# EasyEDA schematic schematic.json
TITLE: Sheet_1; REV: 1.0; Date: 2024-08-12; Sheet: 1/1; Drawn By: catechisspyros; Company: Your Company
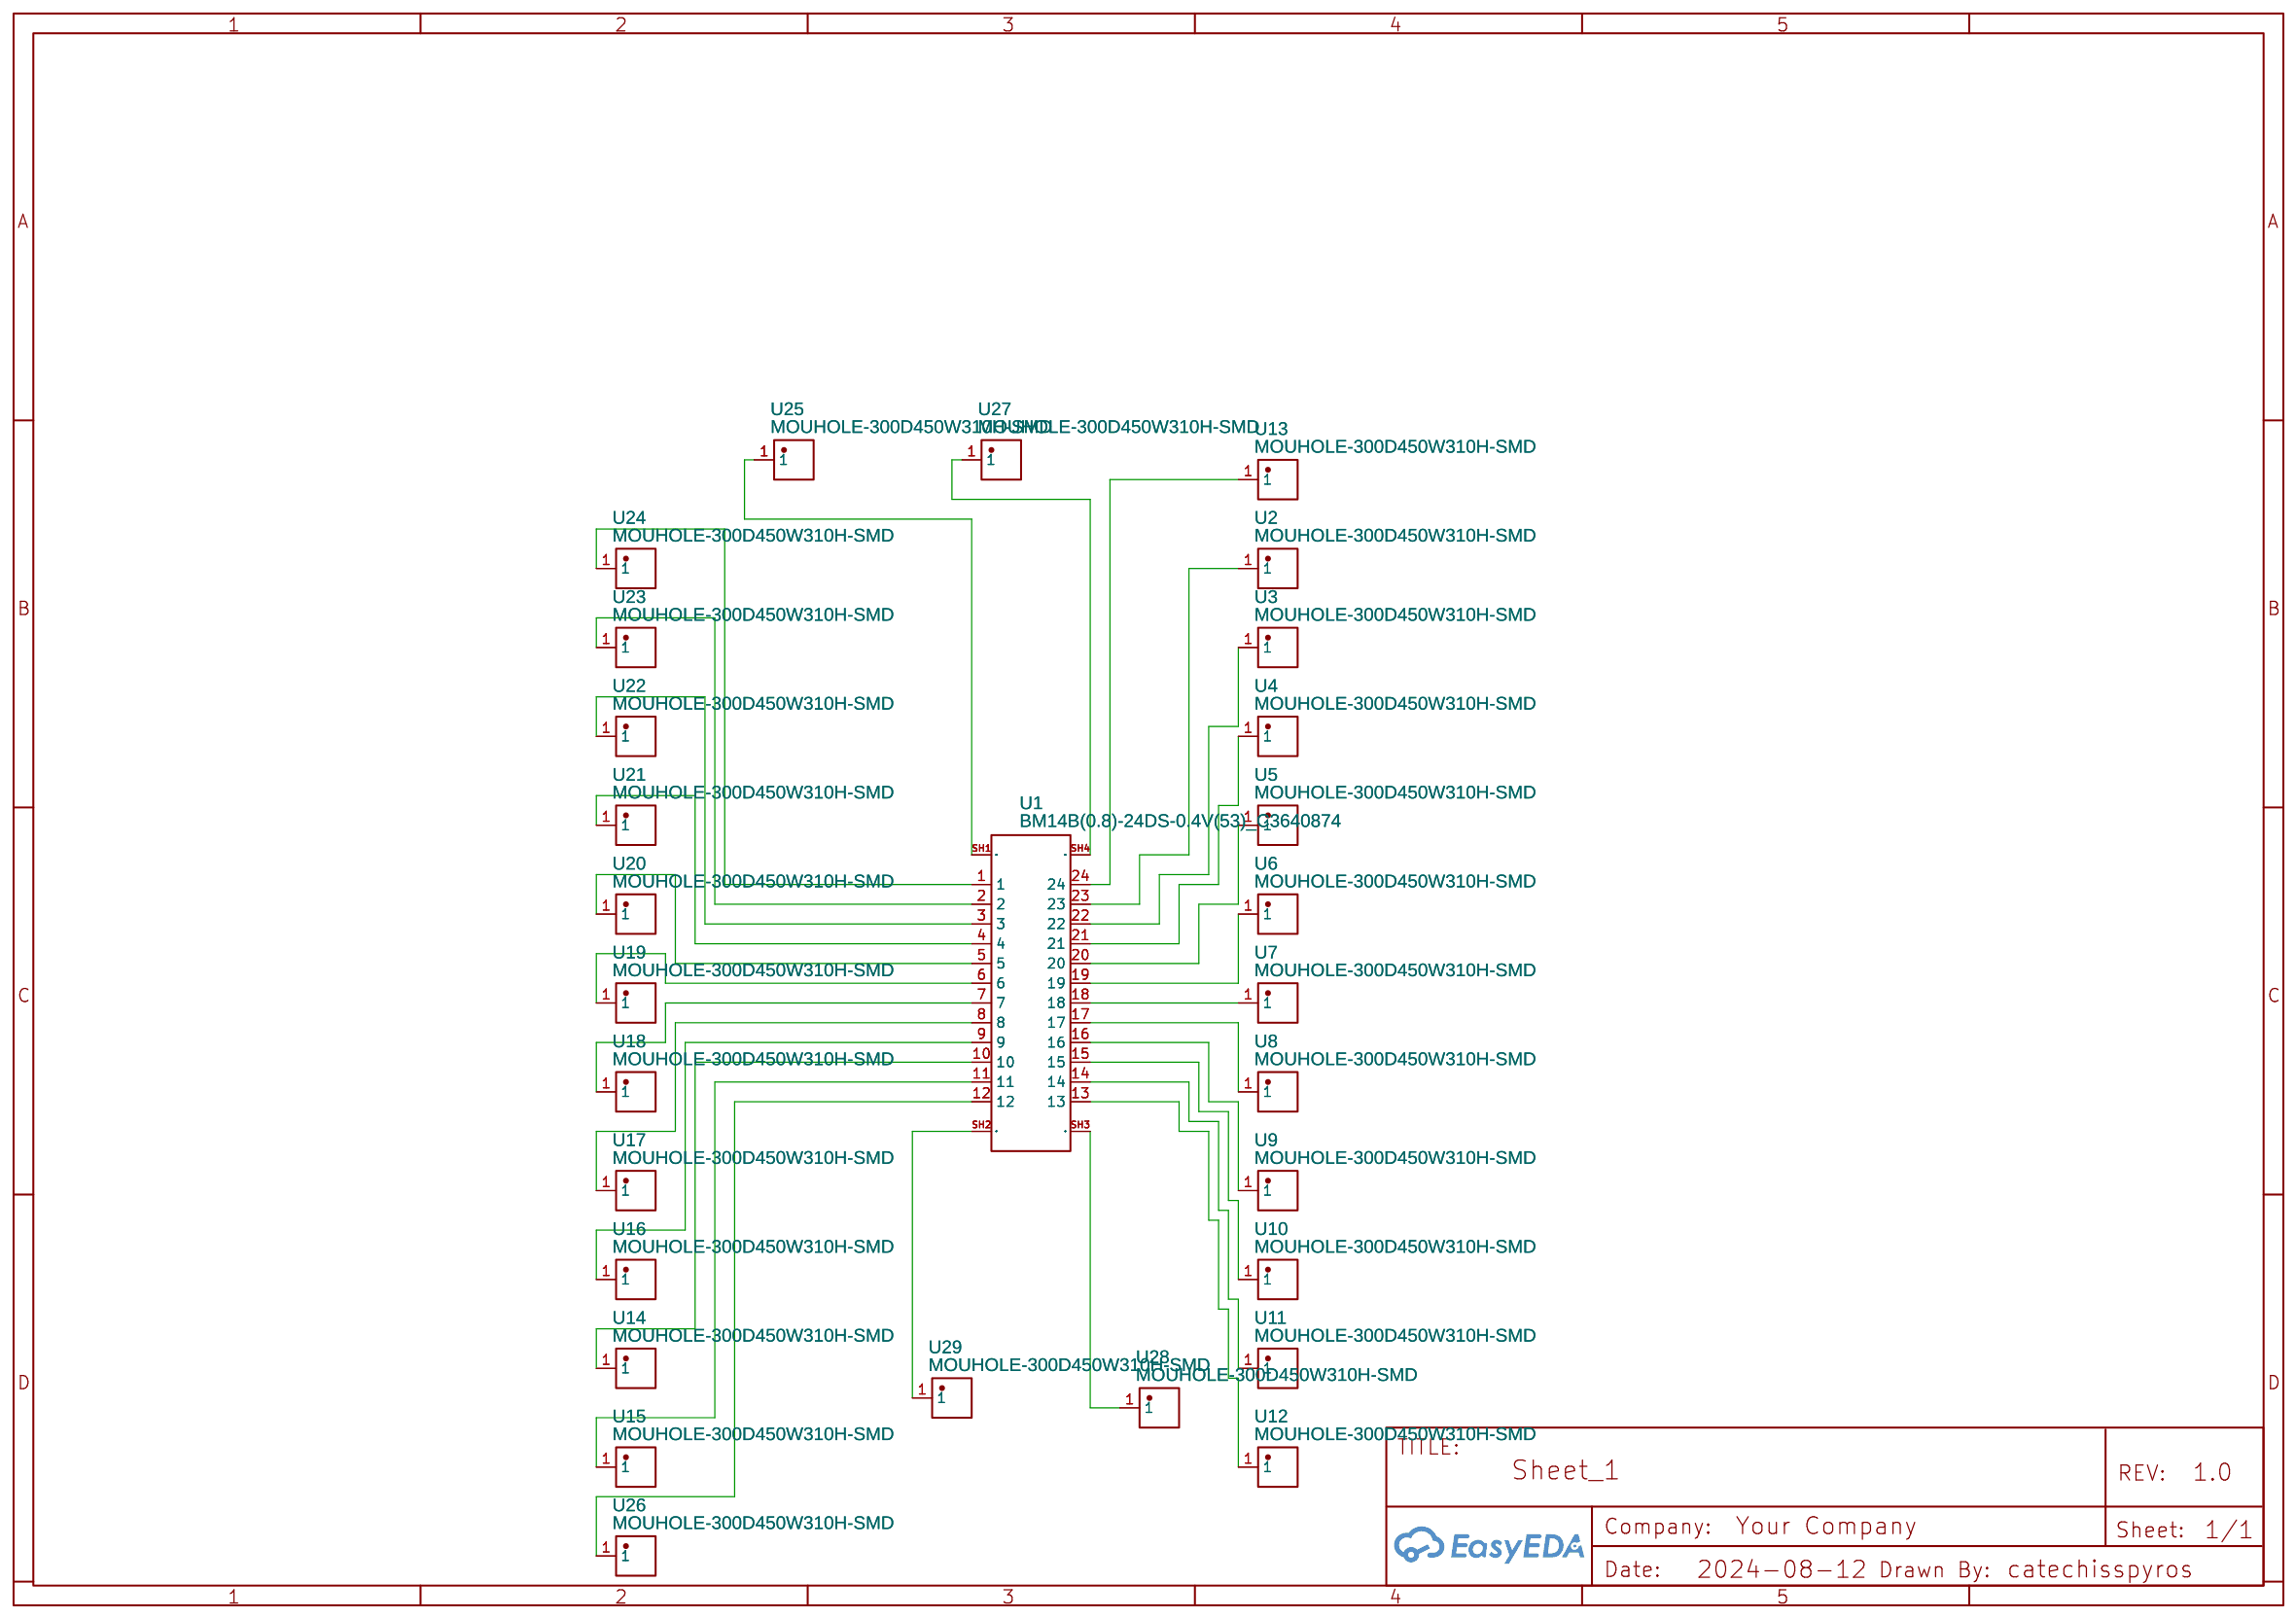
[diagram p0: schematic sheet]

## Parts
U1  BM14B(0.8)-24DS-0.4V(53)_C3640874  [CONN-SMD_BM14B-0.8-24DS-0.4V]
U2  MOUHOLE-300D450W310H-SMD  [SMD_BD4.4-L4.4-D2.8]
U3  MOUHOLE-300D450W310H-SMD  [SMD_BD4.4-L4.4-D2.8]
U4  MOUHOLE-300D450W310H-SMD  [SMD_BD4.4-L4.4-D2.8]
U5  MOUHOLE-300D450W310H-SMD  [SMD_BD4.4-L4.4-D2.8]
U6  MOUHOLE-300D450W310H-SMD  [SMD_BD4.4-L4.4-D2.8]
U7  MOUHOLE-300D450W310H-SMD  [SMD_BD4.4-L4.4-D2.8]
U8  MOUHOLE-300D450W310H-SMD  [SMD_BD4.4-L4.4-D2.8]
U9  MOUHOLE-300D450W310H-SMD  [SMD_BD4.4-L4.4-D2.8]
U10  MOUHOLE-300D450W310H-SMD  [SMD_BD4.4-L4.4-D2.8]
U11  MOUHOLE-300D450W310H-SMD  [SMD_BD4.4-L4.4-D2.8]
U12  MOUHOLE-300D450W310H-SMD  [SMD_BD4.4-L4.4-D2.8]
U13  MOUHOLE-300D450W310H-SMD  [SMD_BD4.4-L4.4-D2.8]
U14  MOUHOLE-300D450W310H-SMD  [SMD_BD4.4-L4.4-D2.8]
U15  MOUHOLE-300D450W310H-SMD  [SMD_BD4.4-L4.4-D2.8]
U16  MOUHOLE-300D450W310H-SMD  [SMD_BD4.4-L4.4-D2.8]
U17  MOUHOLE-300D450W310H-SMD  [SMD_BD4.4-L4.4-D2.8]
U18  MOUHOLE-300D450W310H-SMD  [SMD_BD4.4-L4.4-D2.8]
U19  MOUHOLE-300D450W310H-SMD  [SMD_BD4.4-L4.4-D2.8]
U20  MOUHOLE-300D450W310H-SMD  [SMD_BD4.4-L4.4-D2.8]
U21  MOUHOLE-300D450W310H-SMD  [SMD_BD4.4-L4.4-D2.8]
U22  MOUHOLE-300D450W310H-SMD  [SMD_BD4.4-L4.4-D2.8]
U23  MOUHOLE-300D450W310H-SMD  [SMD_BD4.4-L4.4-D2.8]
U24  MOUHOLE-300D450W310H-SMD  [SMD_BD4.4-L4.4-D2.8]
U25  MOUHOLE-300D450W310H-SMD  [SMD_BD4.4-L4.4-D2.8]
U26  MOUHOLE-300D450W310H-SMD  [SMD_BD4.4-L4.4-D2.8]
U27  MOUHOLE-300D450W310H-SMD  [SMD_BD4.4-L4.4-D2.8]
U28  MOUHOLE-300D450W310H-SMD  [SMD_BD4.4-L4.4-D2.8]
U29  MOUHOLE-300D450W310H-SMD  [SMD_BD4.4-L4.4-D2.8]

## Library data of the parts
U1 = BM14B(0.8)-24DS-0.4V(53)_C3640874: Supplier: LCSC; Supplier Part: C3640874; Manufacturer: HRS(广濑); Manufacturer Part: BM14B(0.8)-24DS-0.4V(53); JLCPCB Part Class: Extended Part; Contributor: lcsc
U2-U29 = MOUHOLE-300D450W310H-SMD: Contributor: lcsc; Supplier: LCSC; Supplier Part: C9900027016; Manufacturer: null; Manufacturer Part: MouHole-300D450W310H-SMD

## Nets
Net-(U1-1): U1.1 U24.1
Net-(U1-2): U1.2 U23.1
Net-(U1-3): U1.3 U22.1
Net-(U1-4): U1.4 U21.1
Net-(U1-5): U1.5 U20.1
Net-(U1-6): U1.6 U19.1
Net-(U1-7): U1.7 U18.1
Net-(U1-8): U1.8 U17.1
Net-(U1-9): U1.9 U16.1
Net-(U1-10): U1.10 U14.1
Net-(U1-11): U1.11 U15.1
Net-(U1-12): U1.12 U26.1
Net-(U1-13): U1.13 U12.1
Net-(U1-14): U1.14 U11.1
Net-(U1-15): U1.15 U10.1
Net-(U1-16): U1.16 U9.1
Net-(U1-17): U1.17 U8.1
Net-(U1-18): U1.18 U7.1
Net-(U1-19): U1.19 U6.1
Net-(U1-20): U1.20 U5.1
Net-(U1-21): U1.21 U4.1
Net-(U1-22): U1.22 U3.1
Net-(U1-23): U1.23 U2.1
Net-(U1-24): U1.24 U13.1
Net-(U1-SH1): U1.SH1 U25.1
Net-(U1-SH2): U1.SH2 U29.1
Net-(U1-SH3): U1.SH3 U28.1
Net-(U1-SH4): U1.SH4 U27.1
